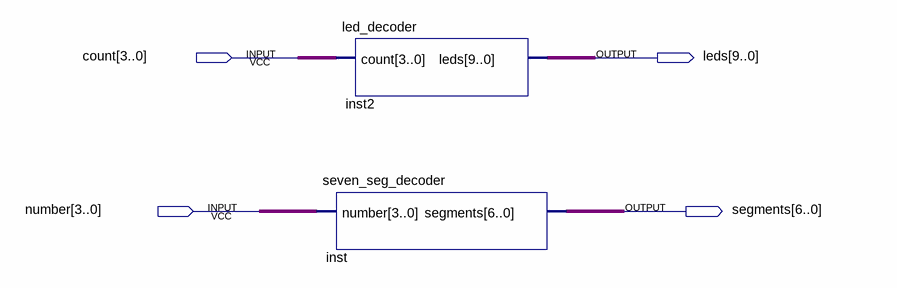
[diagram p0: schematic sheet]
// Quartus schematic lab1_top_level_test.bdf as structural Verilog: 2 symbols, 4 pins
module lab1_top_level_test (
  input  [3:0] count,
  input  [3:0] number,
  output [9:0] leds,
  output [6:0] segments
);

  led_decoder inst2 (.count(count), .leds(leds));
  seven_seg_decoder inst (.number(number), .segments(segments));
endmodule
